# EAGLE design NRF9160ModuleEV1 (EAGLE 9.1.0)
COMPANY: ADAFRUIT INDUSTRIES; DRAWN: KTOWN; REV: A
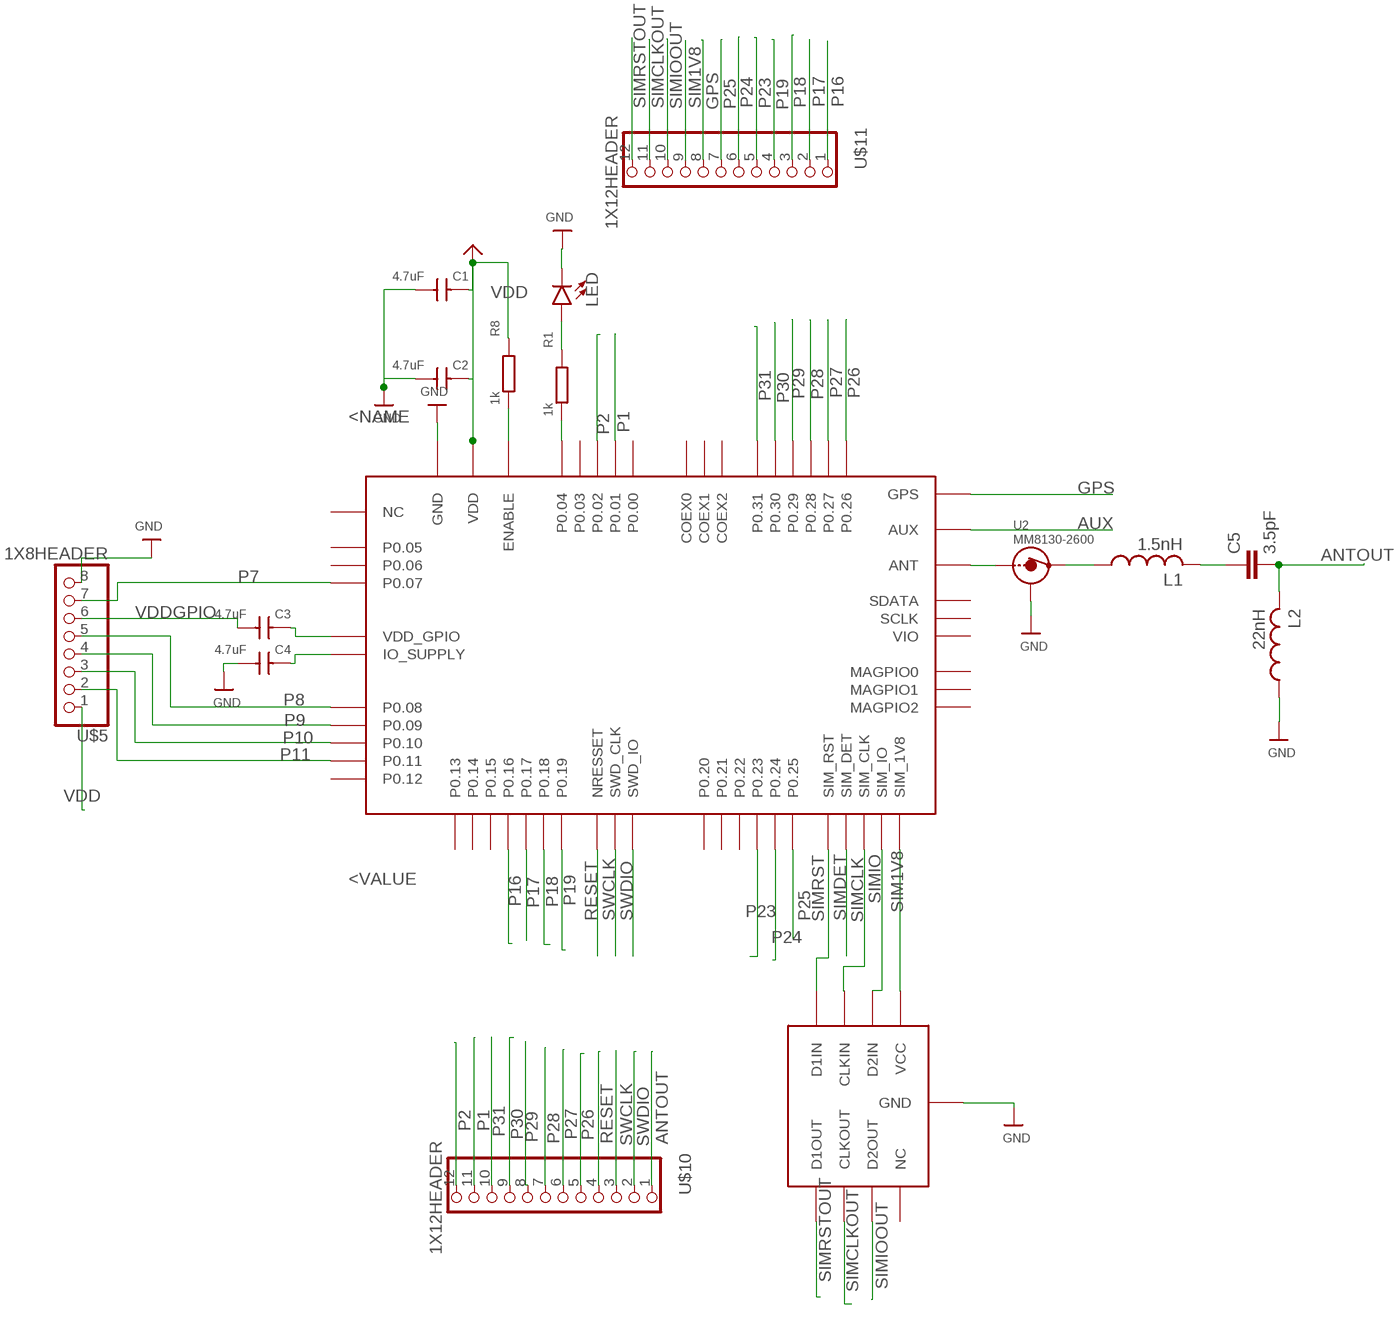
[diagram p0: schematic, sheet 1]

## Parts
C1  4.7uF  CAP0402  [C-0402]
C2  4.7uF  CAP0402  [C-0402]
C3  4.7uF  CAP0402  [C-0402]
C4  4.7uF  CAP0402  [C-0402]
C5  3.5pF  CAPACITOR_0402_N  [RESC0402_N]
IC1  NRF9160  [NRF9160]
L1  1.5nH  INDUCTOR_0603_N  [RESC0603_N]
L2  22nH  INDUCTOR_0603_N  [RESC0603_N]
LED  LED0603  [LED-0603]
R1  1k  RESR0402  [R0402]
R8  1k  RESR0402  [R0402]
U1  TPD3F303  [8-UFDFN]
U2  MM8130-2600  [MM8130-2600]
U$5  1X8HEADER  [8X1]
U$10  1X12HEADER  [1X12]
U$11  1X12HEADER  [1X12]

## Nets
ANTOUT: C5.2 L2.2 U$10.1
AUX: IC1.AUX
GND: C1.1 C2.1 C4.1 IC1.GND@1(GND) IC1.GND@2(GND) IC1.GND@3(GND) IC1.GND@4(GND) IC1.GND@5(GND) IC1.GND@6(GND) IC1.GND@7(GND) IC1.GND@8(GND) IC1.GND@9(GND) IC1.GND@10(GND) IC1.GND@11(GND) IC1.GND@12(GND) IC1.GND@13(GND) IC1.GND@14(GND) IC1.GND@15(GND) IC1.GND@16(GND) IC1.GND@17(GND) IC1.GND@18(GND) IC1.GND@19(GND) IC1.GND@20(GND) IC1.GND@21(GND) IC1.GND@22(GND) IC1.GND@23(GND) IC1.GND@24(GND) IC1.GND@25(GND) IC1.GND@26(GND) IC1.GND@27(GND) IC1.GND@28(GND) IC1.GND@29(GND) IC1.GND@30(GND) IC1.GND@31(GND) IC1.GND@32(GND) IC1.GND@33(GND) IC1.GND@34(GND) IC1.GND@35(GND) IC1.GND_SHIELD@1(GND) IC1.GND_SHIELD@2(GND) IC1.GND_SHIELD@3(GND) IC1.GND_SHIELD@4(GND) IC1.GND_SHIELD@5(GND) IC1.GND_SHIELD@6(GND) IC1.GND_SHIELD@7(GND) IC1.GND_SHIELD@8(GND) IC1.GND_SHIELD@9(GND) IC1.GND_SHIELD@10(GND) IC1.GND_SHIELD@11(GND) IC1.GND_SHIELD@12(GND) IC1.GND_SHIELD@13(GND) IC1.GND_SHIELD@14(GND) IC1.GND_SHIELD@15(GND) IC1.GND_SHIELD@16(GND) IC1.GND_SHIELD@17(GND) IC1.GND_SHIELD@18(GND) IC1.GND_SHIELD@19(GND) IC1.GND_SHIELD@20(GND) IC1.GND_SHIELD@21(GND) IC1.GND_SHIELD@22(GND) IC1.GND_SHIELD@23(GND) IC1.GND_SHIELD@24(GND) IC1.GND_SHIELD@25(GND) IC1.GND_SHIELD@26(GND) IC1.GND_SHIELD@27(GND) IC1.GND_SHIELD@28(GND) IC1.GND_SHIELD@29(GND) IC1.GND_SHIELD@30(GND) IC1.GND_SHIELD@31(GND) IC1.GND_SHIELD@32(GND) IC1.GND_SHIELD@33(GND) IC1.GND_SHIELD@34(GND) L2.1 LED.C U1.P$9(GND) U2.1 U2.2 U2.3 U2.4 U$5.8
GPS: IC1.GPS U$11.8
N$1: IC1.ENABLE R8.2
N$2: C4.2 IC1.IO_SUPPLY
N$3: C3.2 IC1.VDD_GPIO
N$4: IC1.P0.04 R1.2
N$5: LED.A R1.1
N$6: IC1.ANT U2.IN
N$7: L1.1 U2.OUT
N$8: C5.1 L1.2
P1: IC1.P0.01 U$10.11
P2: IC1.P0.02 U$10.12
P7: IC1.P0.07 U$5.7
P8: IC1.P0.08 U$5.5
P9: IC1.P0.09 U$5.4
P10: IC1.P0.10 U$5.3
P11: IC1.P0.11 U$5.2
P16: IC1.P0.16 U$11.1
P17: IC1.P0.17 U$11.2
P18: IC1.P0.18 U$11.3
P19: IC1.P0.19 U$11.4
P23: IC1.P0.23 U$11.5
P24: IC1.P0.24 U$11.6
P25: IC1.P0.25 U$11.7
P26: IC1.P0.26 U$10.5
P27: IC1.P0.27 U$10.6
P28: IC1.P0.28 U$10.7
P29: IC1.P0.29 U$10.8
P30: IC1.P0.30 U$10.9
P31: IC1.P0.31 U$10.10
RESET: IC1.NRESET(NRESSET) U$10.4
SIM1V8: IC1.SIM_1V8 U1.VCC U$11.9
SIMCLK: IC1.SIM_CLK U1.CLKIN
SIMCLKOUT: U1.CLKOUT U$11.11
SIMDET: IC1.SIM_DET
SIMIO: IC1.SIM_IO U1.D2IN
SIMIOOUT: U1.D2OUT U$11.10
SIMRST: IC1.SIM_RST U1.D1IN
SIMRSTOUT: U1.D1OUT U$11.12
SWCLK: IC1.SWDCLK(SWD_CLK) U$10.3
SWDIO: IC1.SWDIO(SWD_IO) U$10.2
VDD: C1.2 C2.2 IC1.VDD@1(VDD) IC1.VDD@2(VDD) R8.1 U$5.1 ; supply symbol labelled VBUS
VDDGPIO: C3.1 U$5.6
Unconnected: IC1.COEX0 IC1.COEX1 IC1.COEX2 IC1.MAGPIO0 IC1.MAGPIO1 IC1.MAGPIO2 IC1.NC1(NC) IC1.NC2(NC) IC1.NC3(NC) IC1.NC4(NC) IC1.NC5(NC) IC1.NC6(NC) IC1.NC7(NC) IC1.NC8(NC) IC1.NC9(NC) IC1.NC10(NC) IC1.NC11(NC) IC1.NC12(NC) IC1.NC13(NC) IC1.NC14(NC) IC1.NC15(NC) IC1.NC16(NC) IC1.NC17(NC) IC1.NC18(NC) IC1.NC19(NC) IC1.NC20(NC) IC1.NC21(NC) IC1.NC22(NC) IC1.NC23(NC) IC1.NC24(NC) IC1.NC25(NC) IC1.NC26(NC) IC1.NC27(NC) IC1.NC28(NC) IC1.NC29(NC) IC1.NC30(NC) IC1.NC31(NC) IC1.NC32(NC) IC1.NC33(NC) IC1.NC34(NC) IC1.NC35(NC) IC1.P0.00 IC1.P0.03 IC1.P0.05 IC1.P0.06 IC1.P0.12 IC1.P0.13 IC1.P0.14 IC1.P0.15 IC1.P0.20 IC1.P0.21 IC1.P0.22 IC1.SCLK IC1.SDATA IC1.VIO U1.NC

## Library data of the parts
C1-C4 = NANO2:CAP: CAP
C5 = NordicMisc:CAPACITOR: Generic chip capacitor
IC1 = nRF9160:NRF9160
L1 L2 = NordicMisc:INDUCTOR: Generic chip inductor
LED = SparkFun-LED:LED: LED (Generic) Standard schematic elements and footprints for 5mm, 3mm, 1206, and 0603 sized LEDs. Generic LEDs with no color specified.
R1 R8 = 1RedBeard:RES: RES
U1 = TI TPD3F303 SIM EMI Filter:TPD3F303
U2 = NordicMisc:MM8130-2600
U$5 = Headers:1X8HEADER
U$10 U$11 = Headers:1X12HEADER

## Board
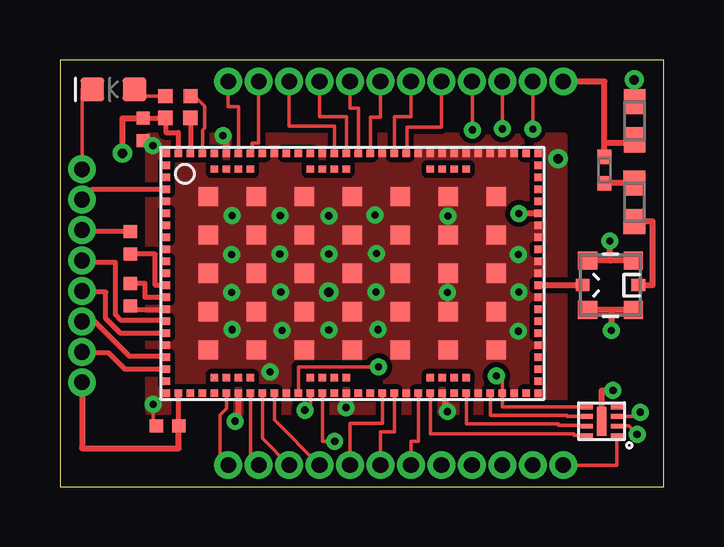
[diagram p1: board, top side]
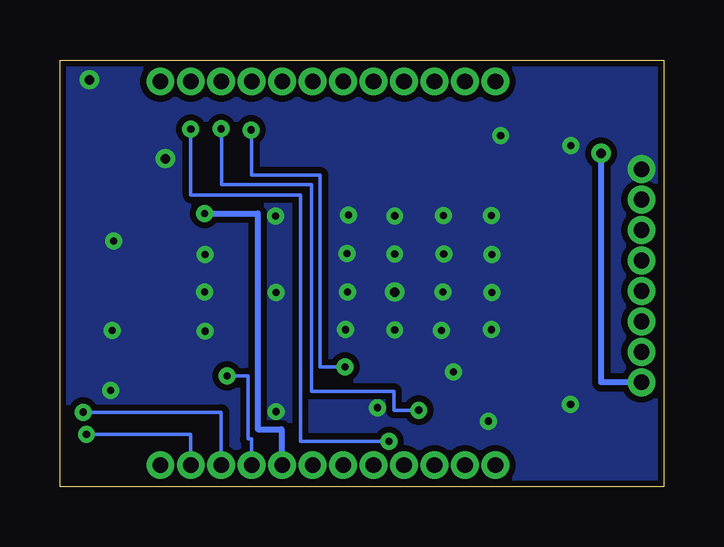
[diagram p2: board, bottom side, seen from below]

Size 25.17 x 17.8 mm. Coordinates in mm from the lower left corner, seen from the top.
Outline: 25.17,17.8 0,17.8 0,0 25.17,0 25.17,17.8
Copper layers (1*16): Top 0.035mm / dielectric 1.5mm / Bottom 0.035mm
Design rules "adafruit *": minimum track width 6mil, minimum drill 0.3mm, track to track 8mil, track to pad 8mil, pad to pad 8mil, via to via 8mil, smd to smd 0mil, copper to edge 10mil, drill to drill 8mil, minimum pad ring 10mil, minimum via ring 8mil, stop-mask expansion 2mil, vias tented up to drill 20mil, thermal gap 10mil
tRestrict: area 22.9,7.9 to 23.1,8.3; area 24.9,12.1 to 25,12.4; area 24.3,12.1 to 24.4,12.4

### Footprints (pad centres in the part's own frame; a part is rotated, then mirrored left to right if it is on the bottom)
C-0402 = smd 0.55 x 0.55: 1 -0.47,0; 2 0.47,0
RESC0402_N = smd 0.6 x 0.6: 1 -0.55,0; 2 0.55,0
NRF9160 = smd 0.3 x 0.3: ANT 15.75,4.75; AUX 15.75,6.25; COEX0 5.25,10.25; COEX1 5.75,10.25; COEX2 6.25,10.25; ENABLE 1.25,10.25; GND_SHIELD@1 0.25,10.25; GND_SHIELD@2 0.25,8.25; GND_SHIELD@3 0.25,6.25; GND_SHIELD@4 0.25,3.75; GND_SHIELD@5 0.25,2.25; GND_SHIELD@6 0.25,0.25; GND_SHIELD@7 3.25,0.25; GND_SHIELD@8 5.25,0.25; GND_SHIELD@9 7.75,0.25; GND_SHIELD@10 10.25,0.25; GND_SHIELD@11 11.75,0.25; GND_SHIELD@12 13.25,0.25; GND_SHIELD@13 14.75,0.25; GND_SHIELD@14 15.75,0.25; GND_SHIELD@15 15.75,2.25; GND_SHIELD@16 15.75,4.25; GND_SHIELD@17 15.75,5.25; GND_SHIELD@18 15.75,5.75; GND_SHIELD@19 15.75,6.75; GND_SHIELD@20 15.75,7.25; GND_SHIELD@21 15.75,10.25; GND_SHIELD@22 14.75,10.25; GND_SHIELD@23 14.25,10.25; GND_SHIELD@24 13.75,10.25; GND_SHIELD@25 13.25,10.25; GND_SHIELD@26 12.75,10.25; GND_SHIELD@27 12.25,10.25; GND_SHIELD@28 11.75,10.25; GND_SHIELD@29 11.25,10.25; GND_SHIELD@30 10.75,10.25; GND_SHIELD@31 9.25,10.25; GND_SHIELD@32 6.75,10.25; GND_SHIELD@33 4.75,10.25; GND_SHIELD@34 2.75,10.25; GPS 15.75,7.75; IO_SUPPLY 0.25,4.25; MAGPIO0 15.75,1.75; MAGPIO1 15.75,1.25; MAGPIO2 15.75,0.75; NC1 0.25,7.75; NC2 0.25,7.25; NC3 0.25,6.75; NC4 0.25,5.75; NC5 0.25,5.25; NC6 15.25,0.25; NC7 15.75,8.25; NC8 15.75,8.75; NC9 15.75,9.25; NC10 15.75,9.75; NC11 15.25,10.25; NC12 2.25,0.9; NC13 2.75,0.9; NC14 3.25,0.9; NC15 3.75,0.9; NC16 6.25,0.9; NC17 6.75,0.9; NC18 7.25,0.9; NC19 7.75,0.9; NC20 11.25,0.9; NC21 11.75,0.9; NC22 12.25,0.9; NC23 12.75,0.9; NC24 12.75,9.6; NC25 12.25,9.6; NC26 11.75,9.6; NC27 11.25,9.6; NC28 7.75,9.6; NC29 7.25,9.6; NC30 6.75,9.6; NC31 6.25,9.6; NC32 3.75,9.6; NC33 3.25,9.6; NC34 2.75,9.6; NC35 2.25,9.6; NRESET 5.75,0.25; P0.00 4.25,10.25; P0.01 3.75,10.25; P0.02 3.25,10.25; P0.03 2.25,10.25; P0.04 1.75,10.25; P0.05 0.25,9.75; P0.06 0.25,9.25; P0.07 0.25,8.75; P0.08 0.25,3.25; P0.09 0.25,2.75; P0.10 0.25,1.75; P0.11 0.25,1.25; P0.12 0.25,0.75; P0.13 1.25,0.25; P0.14 1.75,0.25; P0.15 2.25,0.25; P0.16 2.75,0.25; P0.17 3.75,0.25; P0.18 4.25,0.25; P0.19 4.75,0.25; P0.20 7.25,0.25; P0.21 8.25,0.25; P0.22 8.75,0.25; P0.23 9.25,0.25; P0.24 9.75,0.25; P0.25 10.75,0.25; P0.26 10.25,10.25; P0.27 9.75,10.25; P0.28 8.75,10.25; P0.29 8.25,10.25; P0.30 7.75,10.25; P0.31 7.25,10.25; SCLK 15.75,3.25; SDATA 15.75,3.75; SIM_1V8 14.25,0.25; SIM_CLK 12.75,0.25; SIM_DET 12.25,0.25; SIM_IO 13.75,0.25; SIM_RST 11.25,0.25; SWDCLK 6.25,0.25; SWDIO 6.75,0.25; VDD@1 0.75,0.25; VDD@2 0.75,10.25; VDD_GPIO 0.25,4.75; VIO 15.75,2.75 | smd 0.8 x 0.8: GND@1 2,8.45; GND@2 4,8.45; GND@3 6,8.45; GND@4 8,8.45; GND@5 10,8.45; GND@6 12,8.45; GND@7 14,8.45; GND@8 2,6.85; GND@9 4,6.85; GND@10 6,6.85; GND@11 8,6.85; GND@12 10,6.85; GND@13 12,6.85; GND@14 14,6.85; GND@15 2,5.25; GND@16 4,5.25; GND@17 6,5.25; GND@18 8,5.25; GND@19 10,5.25; GND@20 12,5.25; GND@21 14,5.25; GND@22 2,3.65; GND@23 4,3.65; GND@24 6,3.65; GND@25 8,3.65; GND@26 10,3.65; GND@27 12,3.65; GND@28 14,3.65; GND@29 2,2.05; GND@30 4,2.05; GND@31 6,2.05; GND@32 8,2.05; GND@33 10,2.05; GND@34 12,2.05; GND@35 14,2.05
RESC0603_N = smd 1.05 x 0.9: 1 -0.8,0; 2 0.8,0
LED-0603 = smd 1 x 1: A -0.877,0; C 0.877,0
R0402 = smd 0.6 x 0.6: 1 -0.525,0; 2 0.525,0
8-UFDFN = smd 0.2 x 0.5: CLKIN 0.2,-0.625; CLKOUT 0.2,0.625; D1IN 0.6,-0.625; D1OUT 0.6,0.625; D2IN -0.2,-0.625; D2OUT -0.2,0.625; NC -0.6,0.625; VCC -0.6,-0.625 | smd 1.2 x 0.4: P$9 0,0
MM8130-2600 = smd 0.75 x 0.8: 1 -1.025,0.95; 2 1.025,0.95; 3 -1.025,-0.95; 4 1.025,-0.95 | smd 0.5 x 0.58: IN 0,1.16; OUT 0,-1.16
8X1 = drill 0.65: 1 -4.445,0; 2 -3.175,0; 3 -1.905,0; 4 -0.635,0; 5 0.635,0; 6 1.905,0; 7 3.175,0; 8 4.445,0
1X12 = drill 0.65: 1 -6.985,0; 2 -5.715,0; 3 -4.445,0; 4 -3.175,0; 5 -1.905,0; 6 -0.635,0; 7 0.635,0; 8 1.905,0; 9 3.175,0; 10 4.445,0; 11 5.715,0; 12 6.985,0

### Placement (x,y rotation side)
C1  3.47,14.9 90 top
C2  4.49,2.55 0 top
C3  2.93,10.17 270 top
C4  2.94,8.01 90 top
C5  22.7,13.21 90 top
IC1  4.19,3.65 0 top
L1  23.95,11.87 90 top
L2  23.95,15.27 270 top
LED  2.23,16.57 180 top
R1  4.92,16.29 0 top
R8  4.92,15.38 0 top
U1  22.58,2.73 270 top
U2  22.95,8.4 90 top
U$5  0.92,8.8 90 top
U$10  14,16.9 180 top
U$11  14,0.9 0 top

### Tracks (layer width: path | path; a pad name or v marks a point on that pad's centre or on a via)
ANTOUT
  Top 0.254: C5.2 22.7,14.34 | 22.7,14.34 22.7,16.9 U$10.1 | L2.2 23.95,14.34 22.7,14.34
GND  (via drill 0.3, 0.39)
  Top 0.152: C2.1 3.88,2.54 v3.88,3.44 | C1.1 3.87,14.43 v3.87,14.22 | IC1.GND_SHIELD@11 16.01,3.9 16.01,3.47 16.16,3.47 v16.16,3.13 | LED.C 0.92,16.57 U$5.8
  Top 0.203: C4.1 2.94,7.4 IC1.GND_SHIELD@4
  Top 0.254: U1.P$9 22.58,4.01 v23.06,4.01 | v7.3,2.73 7.44,2.73 IC1.GND_SHIELD@7 | IC1.GND_SHIELD@34 6.94,14.64 v6.79,14.64 | v23.94,16.97 23.95,16.97 L2.1 | U2.4 22.96,9.43 | 22.96,9.43 U2.2 | U2.3 22.96,7.38 | 22.96,7.38 U2.1 | 22.96,7.38 22.99,7.36 v22.99,6.52 | 22.96,9.43 22.93,9.46 v22.93,10.25
  Bottom 0.254: v16.16,3.13 15.9,3.13
  other vias: 11.21,8.12 20.77,13.68 8.76,4.79 11.93,3.3 19.11,9.69 19.11,6.49 16.18,11.29 16.16,8.1 13.14,11.34 7.18,11.32 9.19,11.32 11.21,11.3 7.16,9.68 9.17,9.7 11.21,9.7 13.2,9.72 13.18,8.13 13.26,6.55 19.14,8.13 9.21,8.13 7.16,8.11 7.18,6.55 9.26,6.51 11.21,6.53
  pour Bottom (isolate 0.254, no thermals): -0.75,18.07 26.72,18.3 26.83,-0.13 -0.64,-0.37
  pour Top (no thermals): 21.05,14.64 3.66,14.64 3.66,3.12 21.05,3.12
GPS  (via drill 0.3)
  Top 0.254: IC1.GPS v19.13,11.4
  Bottom 0.254: v19.13,11.4 16.93,11.4 16.93,2.4 15.93,2.4 15.93,0.9 U$11.8
N$1
  Top 0.203: R8.2 IC1.ENABLE
N$2
  Top 0.203: IC1.IO_SUPPLY 3.55,7.9 3.55,8.48 C4.2
N$3
  Top 0.203: IC1.VDD_GPIO 3.97,8.4 3.97,9.71 C3.2
N$4
  Top 0.152: IC1.P0.04 5.94,14.88 6.02,14.96 6.02,15.87 5.61,16.29 R1.2
N$5
  Top 0.152: R1.1 3.11,16.29 LED.A
N$6
  Top 0.254: U2.IN IC1.ANT
N$7
  Top 0.254: U2.OUT 24.55,8.4 24.71,8.4 24.71,11.06 L1.1
N$8
  Top 0.254: L1.2 C5.1
P1
  Top 0.152: IC1.P0.01 8.01,13.9 8.01,14.33 8.29,14.33 U$10.11
P2
  Top 0.152: IC1.P0.02 7.44,15.85 7.01,15.85 U$10.12 | U$10.12
P7
  Top 0.203: U$5.7 1.34,12.4 IC1.P0.07
P8
  Top 0.203: IC1.P0.08 4.39,6.95 2.55,6.95 2.31,7.18 2.31,9.36 0.99,9.36 U$5.5
P9
  Top 0.203: 1.91,8.12 1.91,7.01 2.52,6.4 IC1.P0.09 | 1.91,8.12 | 1.91,8.12 0.96,8.12 U$5.4
P10
  Top 0.203: IC1.P0.10 4.39,5.45 2.9,5.45 1.5,6.85 | 1.5,6.85 1.49,6.85 | U$5.3 1.45,6.89 1.5,6.85
P11
  Top 0.203: IC1.P0.11 2.71,4.9 2.04,5.57 0.97,5.57 U$5.2
P16
  Top 0.152: IC1.P0.16 6.94,3.27 6.67,3 6.67,1.25 U$11.1
P17
  Top 0.152: IC1.P0.17 7.94,1.25 U$11.2
P18
  Top 0.152: IC1.P0.18 8.44,2.02 U$11.3
P19
  Top 0.152: IC1.P0.19 8.94,2.79 U$11.4
P23
  Top 0.152: U$11.5 12.1,2.64 13.44,2.64 IC1.P0.23
P24
  Top 0.152: U$11.6 13.37,2.28 13.94,2.28 IC1.P0.24
P25
  Top 0.152: U$11.7 14.63,1.89 14.94,1.89 IC1.P0.25
P26
  Top 0.152: IC1.P0.26 14.46,13.9 14.46,15 15.9,15 U$10.5
P27
  Top 0.152: 14.01,13.9 IC1.P0.27 13.94,15.43 14.63,15.43 U$10.6
P28
  Top 0.152: 13.01,13.9 IC1.P0.28 12.94,15.42 13.37,15.42 U$10.7
P29
  Top 0.152: IC1.P0.29 12.44,15.79 12.09,15.79 U$10.8
P30
  Top 0.152: IC1.P0.30 11.94,15.44 10.82,15.44 U$10.9
P31
  Top 0.152: IC1.P0.31 11.44,15.05 9.55,15.05 U$10.10
RESET  (via drill 0.3)
  Top 0.152: IC1.NRESET 9.94,4.99 v13.29,4.99 v13.29,5 | U$10.4 17.2,16.88 v17.2,14.88
  Bottom 0.152: v17.2,14.88 17.18,14.86 17.18,13 14.32,13 14.32,5 v13.29,5
SIM1V8  (via drill 0.3)
  Top 0.152: U1.VCC 18.44,3.33 IC1.SIM_1V8 18.44,4.63 v18.2,4.63
  Bottom 0.152: v18.2,4.63 17.33,4.63 17.33,2 17.18,2 U$11.9
SIMCLK
  Top 0.152: IC1.SIM_CLK 16.94,2.62 20.79,2.62 20.79,2.55 21.96,2.55 U1.CLKIN
SIMCLKOUT  (via drill 0.3)
  Top 0.152: 23.23,2.51 U1.CLKOUT 23.71,2.53 v24.07,2.18
  Bottom 0.152: v24.07,2.18 19.71,2.18 U$11.11
SIMIO
  Top 0.152: IC1.SIM_IO 17.94,2.98 21.15,2.98 21.15,2.93 U1.D2IN
SIMIOOUT  (via drill 0.3)
  Top 0.152: U1.D2OUT 24.02,2.93 v24.2,3.11
  Bottom 0.152: v24.2,3.11 18.45,3.11 U$11.10
SIMRST
  Top 0.152: 15.37,3.83 IC1.SIM_RST 15.44,2.21 20.43,2.21 20.43,2.2 21.43,2.2 21.43,2.15 21.96,2.15 U1.D1IN
SIMRSTOUT
  Top 0.152: U$11.12 23.21,0.9 U1.D1OUT
SWCLK  (via drill 0.3)
  Top 0.152: IC1.SWDCLK 10.44,3.19 v10.21,3.19 | U$10.3 v18.45,14.93
  Bottom 0.152: v10.21,3.19 11.25,3.19 11.25,3.98 14.68,3.98 14.68,12.6 18.43,12.6 18.43,14.92 v18.45,14.93
SWDIO  (via drill 0.3)
  Top 0.152: IC1.SWDIO 10.94,1.9 v11.46,1.9 | U$10.2 v19.71,14.92 v19.71,14.91
  Bottom 0.152: v11.46,1.9 15.13,1.9 15.13,12.16 19.71,12.16 v19.71,14.91
VDD  (via drill 0.39)
  Top 0.203: R8.1 | R8.1 4.41,15.38 4.41,14.77 4.94,14.77 IC1.VDD@2 | C2.2 4.96,2.58 4.96,3.88 IC1.VDD@1 | C1.2 R8.1
  Top 0.254: U$5.1 0.92,1.6 4.97,1.6 4.96,1.61 4.96,2.58 | v2.6,13.91 2.6,15.37 C1.2
  Bottom 0.254: U$5.1 2.6,4.36 v2.6,13.91
VDDGPIO
  Top 0.203: C3.1 0.98,10.64 U$5.6